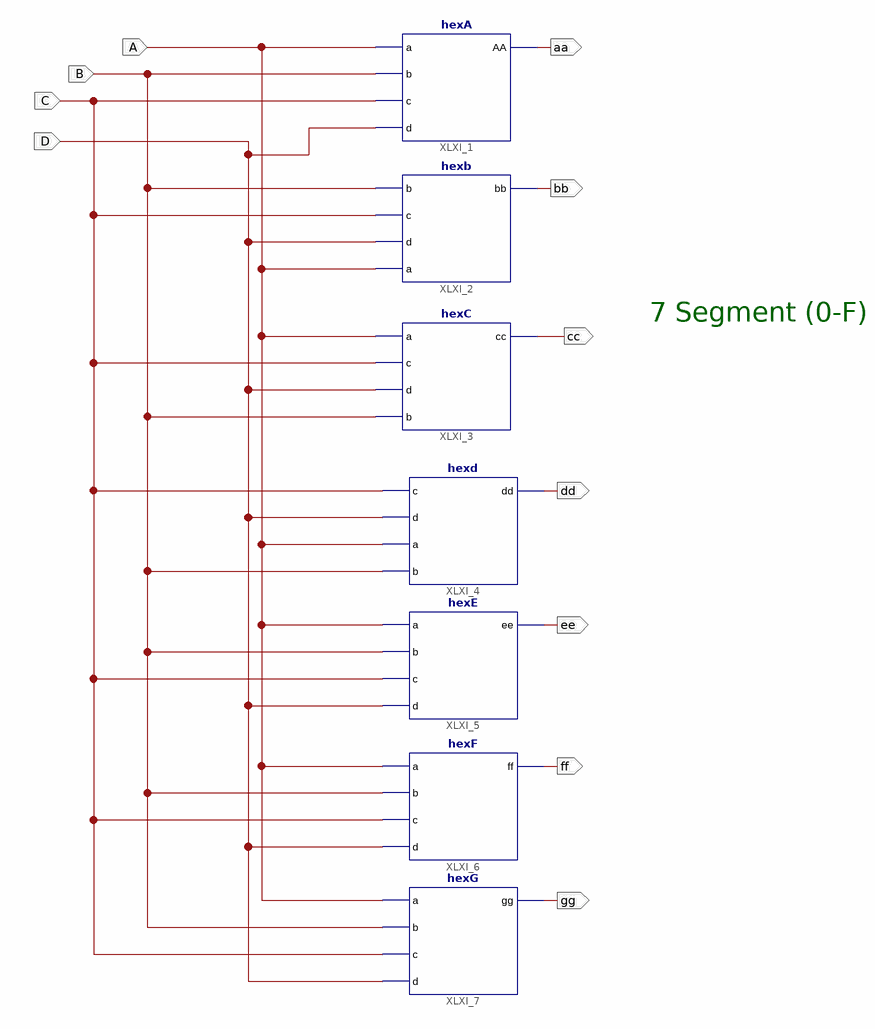
[diagram p0: schematic sheet 1]
// Xilinx ISE schematic hexto7sefment.sch (spartan6) as structural Verilog: 7 symbols, 11 ports
module hexto7sefment (
  input  A,
  input  B,
  input  C,
  input  D,
  output aa,
  output cc,
  output bb,
  output dd,
  output ee,
  output ff,
  output gg
);

  hexA XLXI_1 (.a(A), .b(B), .c(C), .d(D), .AA(aa));
  hexb XLXI_2 (.b(B), .c(C), .d(D), .a(A), .bb(bb));
  hexC XLXI_3 (.a(A), .c(C), .d(D), .b(B), .cc(cc));
  hexd XLXI_4 (.c(C), .d(D), .a(A), .b(B), .dd(dd));
  hexE XLXI_5 (.a(A), .b(B), .c(C), .d(D), .ee(ee));
  hexF XLXI_6 (.a(A), .b(B), .c(C), .d(D), .ff(ff));
  hexG XLXI_7 (.a(A), .b(B), .c(C), .d(D), .gg(gg));

  // Notes on the sheet:
  //   7 Segment (0-F)
endmodule
